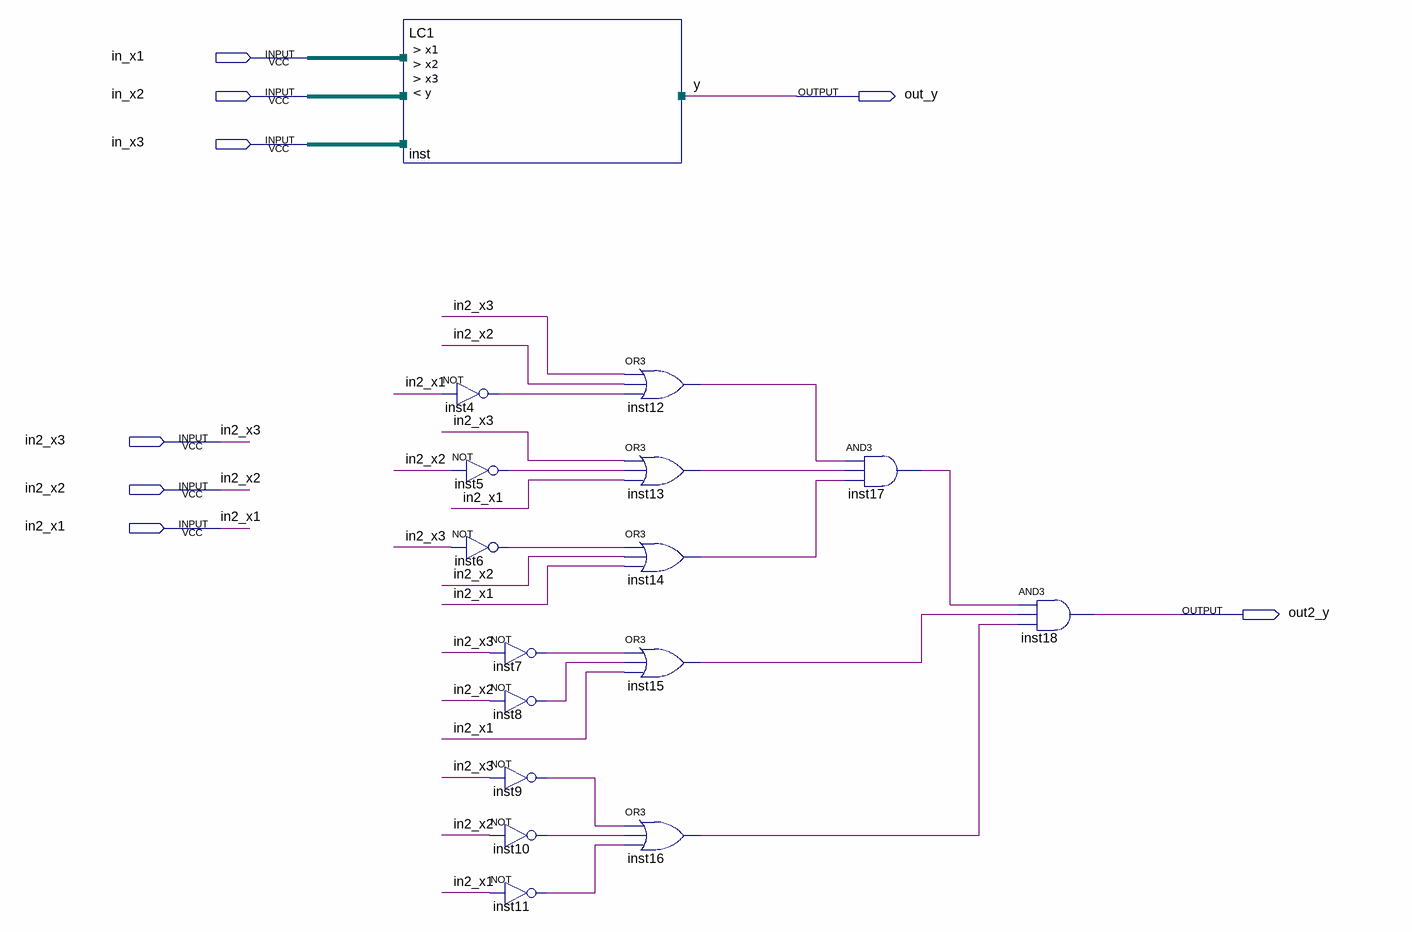
[diagram p0: schematic sheet]
// Quartus schematic CL_Project_v1.bdf as structural Verilog: 16 symbols, 8 pins
module CL_Project_v1 (
  input  in_x1,
  input  in_x2,
  input  in_x3,
  input  in2_x3,
  input  in2_x2,
  input  in2_x1,
  output out_y,
  output out2_y
);

  wire inst4_out, inst5_out, inst6_out, inst7_out, inst8_out, inst9_out, inst10_out, inst11_out, inst12_out,
       inst13_out, inst14_out, inst15_out, inst16_out, inst17_out;

  LC1 inst (.x1(in_x1), .x2(in_x2), .x3(in_x3), .y(out_y));
  not inst4 (inst4_out, in2_x1);
  not inst5 (inst5_out, in2_x2);
  not inst6 (inst6_out, in2_x3);
  not inst7 (inst7_out, in2_x3);
  not inst8 (inst8_out, in2_x2);
  not inst9 (inst9_out, in2_x3);
  not inst10 (inst10_out, in2_x2);
  not inst11 (inst11_out, in2_x1);
  or inst12 (inst12_out, in2_x3, in2_x2, inst4_out);
  or inst13 (inst13_out, in2_x3, inst5_out, in2_x1);
  or inst14 (inst14_out, inst6_out, in2_x2, in2_x1);
  or inst15 (inst15_out, inst7_out, inst8_out, in2_x1);
  or inst16 (inst16_out, inst9_out, inst10_out, inst11_out);
  and inst17 (inst17_out, inst12_out, inst13_out, inst14_out);
  and inst18 (out2_y, inst17_out, inst15_out, inst16_out);

  // Other names for the same wires on the sheet: y = out_y
endmodule
